# Altium schematic sheet MCU.SchDoc
size A4; Date: 31.05.2020; ApprovedBy: WirelessMan; CheckedBy: WirelessMan; Author: WirelessMan; DrawnBy: WirelessMan; Engineer: WirelessMan
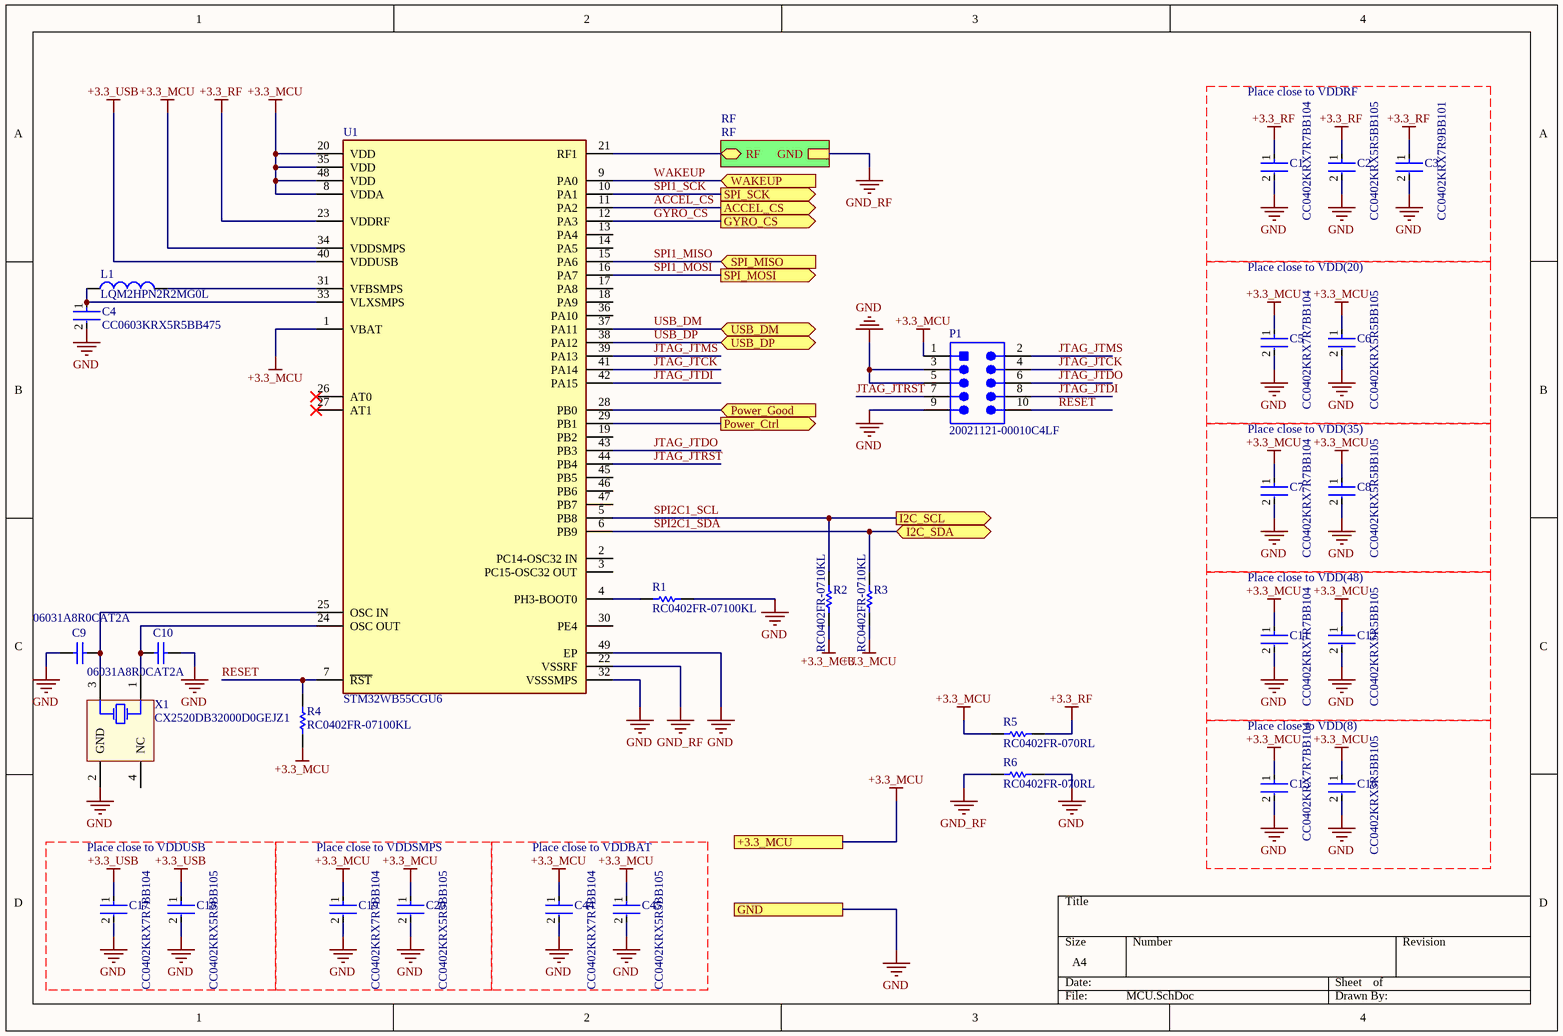
[diagram p0: MCU.SchDoc]

## Parts
C1  CC0402KRX7R7BB104  [FP-CC0402-MFG]
C2  CC0402KRX5R5BB105  [FP-CC0402-MFG]
C3  CC0402KRX7R9BB101  [FP-CC0402-MFG]
C4  CC0603KRX5R5BB475  [FP-CC0603-DA-MFG]
C5  CC0402KRX7R7BB104  [FP-CC0402-MFG]
C6  CC0402KRX5R5BB105  [FP-CC0402-MFG]
C7  CC0402KRX7R7BB104  [FP-CC0402-MFG]
C8  CC0402KRX5R5BB105  [FP-CC0402-MFG]
C9  06031A8R0CAT2A  [CAPC1608X90X35LL15T15]
C10  06031A8R0CAT2A  [CAPC1608X90X35LL15T15]
C11  CC0402KRX7R7BB104  [FP-CC0402-MFG]
C12  CC0402KRX5R5BB105  [FP-CC0402-MFG]
C15  CC0402KRX7R7BB104  [FP-CC0402-MFG]
C16  CC0402KRX5R5BB105  [FP-CC0402-MFG]
C17  CC0402KRX7R7BB104  [FP-CC0402-MFG]
C18  CC0402KRX5R5BB105  [FP-CC0402-MFG]
C19  CC0402KRX7R7BB104  [FP-CC0402-MFG]
C20  CC0402KRX5R5BB105  [FP-CC0402-MFG]
C44  CC0402KRX7R7BB104  [FP-CC0402-MFG]
C45  CC0402KRX5R5BB105  [FP-CC0402-MFG]
L1  LQM2HPN2R2MG0L  [INDC2520X100X60ML20T20]
P1  20021121-00010C4LF  [HDR2X5_SMT]
R1  RC0402FR-07100KL  [RESC1005X40X25NL05T10]
R2  RC0402FR-0710KL  [RESC1005X40X25ML05T10]
R3  RC0402FR-0710KL  [RESC1005X40X25ML05T10]
R4  RC0402FR-07100KL  [RESC1005X40X25NL05T10]
R5  RC0402FR-070RL  [RESC1005X40X25NL05T10]
R6  RC0402FR-070RL  [RESC1005X40X25NL05T10]
U1  STM32WB55CGU6  [FP-STM32WB55CGU6-MFG]
X1  CX2520DB32000D0GEJZ1  [AVX-CX2520DB32000D0GEJZ1-4_V]

## Sub-sheets
RF = RF: RF (bidir), GND

## Ports
+3.3_MCU, ACCEL_CS (out), GND, GYRO_CS (out), I2C_SCL (out), I2C_SDA (bidir), Power_Ctrl (out), Power_Good (in), SPI_MISO (in), SPI_MOSI (out), SPI_SCK (out), USB_DM (bidir), USB_DP (bidir), WAKEUP (in)

## Nets
+3.3_MCU: C5.1 C6.1 C7.1 C8.1 C11.1 C12.1 C15.1 C16.1 C19.1 C20.1 C44.1 C45.1 P1.1 R2.1 R3.1 R4.1 R5.1 U1.1(VBAT) U1.8(VDDA) U1.20(VDD) U1.34(VDDSMPS) U1.35(VDD) U1.48(VDD) ; port +3.3_MCU
+3.3_RF: C1.1 C2.1 C3.1 R5.2 U1.23(VDDRF)
+3.3_USB: C17.1 C18.1 U1.40(VDDUSB)
GND: C1.2 C2.2 C3.2 C4.2 C5.2 C6.2 C7.2 C8.2 C9.1 C10.2 C11.2 C12.2 C15.2 C16.2 C17.2 C18.2 C19.2 C20.2 C44.2 C45.2 P1.3 P1.5 P1.9 R1.1 R6.2 U1.32(VSSSMPS) U1.49(EP) X1.2(GND) ; port GND
GND_RF: R6.1 U1.22(VSSRF) ; sheet RF/GND
ACCEL_CS: U1.11(PA2) ; port ACCEL_CS
GYRO_CS: U1.12(PA3) ; port GYRO_CS
JTAG_JTCK: P1.4 U1.41(PA14)
JTAG_JTDI: P1.8 U1.42(PA15)
JTAG_JTDO: P1.6 U1.43(PB3)
JTAG_JTMS: P1.2 U1.39(PA13)
JTAG_JTRST: P1.7 U1.44(PB4)
Power_Ctrl: U1.29(PB1) ; port Power_Ctrl
Power_Good: U1.28(PB0) ; port Power_Good
RESET: P1.10 R4.2 U1.7(~{RST})
SPI1_MISO: U1.15(PA6) ; port SPI_MISO
SPI1_MOSI: U1.16(PA7) ; port SPI_MOSI
SPI1_SCK: U1.10(PA1) ; port SPI_SCK
SPI2C1_SCL: R2.2 U1.5(PB8) ; port I2C_SCL
SPI2C1_SDA: R3.2 U1.6(PB9) ; port I2C_SDA
USB_DM: U1.37(PA11) ; port USB_DM
USB_DP: U1.38(PA12) ; port USB_DP
WAKEUP: U1.9(PA0) ; port WAKEUP
NetC4_1: C4.1 L1.1 U1.33(VLXSMPS)
NetC9_2: C9.2 U1.25(OSC_IN) X1.3(HOT)
NetC10_1: C10.1 U1.24(OSC_OUT) X1.1(HOT)
NetL1_2: L1.2 U1.31(VFBSMPS)
NetR1_2: R1.2 U1.4(PH3-BOOT0)
NetU1_21: U1.21(RF1) ; sheet RF/RF

Not connected (* = marked no-connect by the designer): U1 2(PC14-OSC32_IN) 3(PC15-OSC32_OUT) 13(PA4) 14(PA5) 17(PA8) 18(PA9) 19(PB2) 26(AT0)* 27(AT1)* 30(PE4) 36(PA10) 45(PB5) 46(PB6) 47(PB7); X1 4(NC)

## Notes on the sheet
- Place close to VDDRF
- Place close to VDD(20)
- Place close to VDD(35)
- Place close to VDD(48)
- Place close to VDD(8)
- Place close to VDDUSB
- Place close to VDDSMPS
- Place close to VDDBAT

## Library data of the parts
C1 C5 C7 C11 C15 C17 C19 C44 = CMP-03422-000048-1: CAP CER 0.1UF 16V X7R 0402; Manufacturer: YAGEO; Material: Ceramic; Automotive Grade: NA; Capacitance: 100 nF; Temperature Coefficient: 30ppm/°C; Tolerance: 0.1; Value: 100 nF; Device Class L1: Passive Components; Temperature Range Low: -55°C; Device Class L3: Ceramic Capacitors; Temperature Characteristic: X7R; Ipc Land Pattern Name: CAPC10050X50; Temperature Range High: +125°C; Voltage Rating: 16 V; Temperature: -55°C to +125°C; RoHS: TRUE; Automotive: No; Height: 0.55mm; Device Class L2: Capacitors; Digikey Description: CAP CER 0.1UF 16V X7R 0402; Package: CC0402; Footprint Url: http://www.yageo.com/exep/pages/download/literatures/UPY-C_GEN_24.pdf; ComponentLink2Description: Datasheet; Category: Cap; Lead Free: Yes; Octopart: https://octopart.com/cc0402krx7r7bb104-yageo-42244624; ComponentLink2URL: http://www.yageo.com/documents/recent/UPY-GP_NP0_16V-to-50V_16.pdf; Manufacturer Part Number: CC0402KRX7R7BB104; Mouser Description: 0402 0.1 uF 16 V ±10 % Tolerance X7R SMT Multilayer Ceramic Capacitor
C2 C6 C8 C12 C16 C18 C20 C45 = CMP-03422-000496-1: CAP CER 1UF 6.3V X5R 0402; Manufacturer: YAGEO; Automotive Grade: NA; Material: Ceramic; Tolerance: 0.1; Temperature Coefficient: 30ppm/°C; Voltage Rating: 6.3 V; Temperature Range Low: -55°C; Digikey Description: CAP CER 1UF 6.3V X5R 0402; Capacitance: 1 uF; Height: 0.55mm; Automotive: No; ComponentLink2URL: http://www.yageo.com/documents/recent/UPY-GP_NP0_16V-to-50V_16.pdf; Device Class L2: Capacitors; RoHS: TRUE; Temperature Range High: +125°C; Device Class L3: Ceramic Capacitors; Device Class L1: Passive Components; Temperature Characteristic: X5R; Package: CC0402; Octopart: https://octopart.com/cc0402krx5r5bb105-yageo-42244618; ComponentLink2Description: Datasheet; Temperature: -55°C to +125°C; Manufacturer Part Number: CC0402KRX5R5BB105; Mouser Description: Multilayer Ceramic Capacitors MLCC - SMD/SMT 1uF 6.3V X5R 10%; Category: Cap; Footprint Url: http://www.yageo.com/exep/pages/download/literatures/UPY-C_GEN_24.pdf; Lead Free: Yes; Ipc Land Pattern Name: CAPC10050X50; Value: 1 uF
C3 = CMP-03422-000006-1: CAP CER 100PF 50V X7R 0402; Manufacturer: YAGEO; Temperature Coefficient: 30ppm/°C; Material: Ceramic; Tolerance: 0.1; Automotive Grade: NA; Device Class L2: Capacitors; Temperature: -55°C to +125°C; Temperature Range Low: -55°C; ComponentLink2Description: Datasheet; Automotive: No; Package: CC0402; Device Class L1: Passive Components; Value: 100 pF; Octopart: https://octopart.com/cc0402krx7r9bb101-yageo-42334067; Device Class L3: Ceramic Capacitors; Category: Cap; Height: 0.55mm; Ipc Land Pattern Name: CAPC10050X50; Digikey Description: CAP CER 100PF 50V X7R 0402; RoHS: TRUE; Footprint Url: http://www.yageo.com/exep/pages/download/literatures/UPY-C_GEN_24.pdf; Manufacturer Part Number: CC0402KRX7R9BB101; Voltage Rating: 50 V; Lead Free: Yes; Temperature Range High: +125°C; Capacitance: 100 pF; Temperature Characteristic: X7R; Mouser Description: Multilayer Ceramic Capacitor, Cc Series, 100 Pf, - 10%, X7r, 50 V, 0402 [1005 Metric]; ComponentLink2URL: http://www.yageo.com/documents/recent/UPY-GP_NP0_16V-to-50V_16.pdf
C4 = CMP-03422-000495-1: CAP CER 4.7UF 6.3V X5R 0603; Manufacturer: YAGEO; Tolerance: 0.1; Temperature Coefficient: 15%; Material: Ceramic; Voltage Rating: 6.3 V; Height: 0.9mm; Temperature Characteristic: X5R; Value: 4.7 uF; ComponentLink2Description: Datasheet; Mouser Description: Multilayer Ceramic Capacitor, CC Series, 4.7 - F, - 10%, X5R, 6.3 V, 0603 [1608 Metric]; Manufacturer Part Number: CC0603KRX5R5BB475; Voltage: 6.3 V; Device Class L3: Ceramic Capacitors; Temperature: -55°C to +125°C; Octopart: https://octopart.com/cc0603krx5r5bb475-yageo-42244632; Digikey Description: CAP CER 4.7UF 6.3V X5R 0603; Package: CC0603-DA; Device Class L2: Capacitors; Category: Cap; Footprint Url: http://www.yageo.com/exep/pages/download/literatures/UPY-C_GEN_24.pdf; ComponentLink2URL: http://www.yageo.com/documents/recent/UPY-GPHC_X7R_6.3V-to-50V_18.pdf; Temperature Range High: +125°C; Automotive: No; Temperature Range Low: -55°C; Lead Free: Yes; Capacitance: 4.7 uF; Device Class L1: Passive Components; RoHS: TRUE
C9 C10 = CMP-2006-04063-1: Manufacturer: AVX Interconnect / Elco; Part Number: 06031A8R0CAT2A
L1 = CMP-1662-00028-1: Chip Inductor, 2.2 uH, +/- 20%, -55 to 125 degC, 1008 (2520 Metric), RoHS, Tape and Reel; Voltage Rating (DC): 50 V; Capacitance: 220 uF; Case\Package: Radial; Lead Pitch: 5 mm; PackageDescription: 2-Pin Surface Mounted Device, Body 2.5 x 2 mm; ComponentLink2URL: http://psearch.en.murata.com/inductor/product/LQM2HPN2R2MG0%23.pdf; Height: 12.5 mm; PackageReference: 1008; Voltage Rating: 50 V; ComponentLink1URL: http://www.murata.com/; Package Quantity: 200; REACH SVHC: No SVHC; ComponentLink1Description: Manufacturer URL; Length: 12.5 mm; Max Operating Temperature: 85 degC; DatasheetVersion: Aug-16; Diameter: 10 mm; RoHSCompliant: true; Packaging: Bulk; Mount: Through Hole; Pins: 2; ComponentLink2Description: Datasheet; Tolerance: 20%; Min Operating Temperature: -40 degC; Radiation Hardening: No
P1 = CMP-2000-05523-1: Male Header, Pitch 1.27 mm, 2 x 5 Position, Height 4.55 mm, -40 to 85 degC, RoHS, Tape and Reel; Brand: FCI; Mating Post Length: 3.05mm; Voltage Rating: 125V; Contact resistance Max: 30MOhm; Number of Positions: 10; Pitch: 1.27mm; Current Rating: 1A; Stack Height: 3mm; Mounting Angle: Vertical; Package Version: Rev. J, 03/2013; Contact Plating: Gold; Packaging: Reel; Package Reference: 20021121; Termination Style: SMD; Series: Minitek; Mounting Technology: SurfaceMount; RoHS: Details; Manufacturer: FCI; Number of Rows: 2; Package Description: 10-Leads Header, Body 3.43 x 6.35, Pitch 1.27 mm; Datasheet URL: https://datasheet.ciiva.com/11749/0900766b8118d62a-11749057.pdf; Gender: Male; Mounting Style: SMD/SMT; Manufacturer URL: http://portal.fciconnect.com/; Factory Pack Quantity: 600; Type: Unshrouded; Number of Positions / Contacts: 10; Datasheet Version: 06/2011; Package URL: https://datasheet.ciiva.com/26853/getdatasheetpartid-177140-26853984.pdf; Product Type: Headers; Contact Material: CopperAlloy; Product Category: Headers&WireHousings
R1 R4 = CMP-2002-07343-1: Manufacturer: Yageo / Phycomp; Part Number: RC0402FR-07100KL
R2 R3 = CMP-2002-07353-1: Manufacturer: Yageo / Phycomp; Part Number: RC0402FR-0710KL
R5 R6 = CMP-2002-07342-1: Manufacturer: Yageo; Part Number: RC0402FR-070RL
U1 = CMP-12105-000013-1: ULTRA-LOW-POWER DUAL CORE ARM CO; Manufacturer: STMicroelectronics; Number Of Cores: 1; Number Of I2C Channels: 2; Interface: I2C,SPI,UART,USART,2-Wire,USB,IrDA,Other; Core Architecture: ARM Cortex-M4; Data Bus Width: 32bits; Memory Size: 1MBytes; Number Of Pwm Channels: 14; Max Supply Voltage: 3.6V; Standoff Height: 0mm; Number Of Timers/Counters: 6; Frequency: 64MHz; Max Junction Temp: +105°C; Number Of I/Os: 30; Min Supply Voltage: 1.71V; Number Of Adc Channels: 13; Ram Size: 256KBytes; Memory Type: FLASH; Octopart: https://octopart.com/stm32wb55cgu6-stmicroelectronics-98750847; Temperature Range High: +105°C; RoHS: TRUE; Number Of Spi Channels: 1; Category: IC; Device Class L1: Integrated Circuits (ICs); Lead Free: Yes; Height: 0.65mm; Number Of A/D Converters: 1; Package: UFQFPN48; Number Of Usb Channels: 1; Number Of Uart Channels: 2; Temperature Range Low: -40°C; Ambient Temperature Range Low: -40°C; Device Class L3: Microcontrollers; Manufacturer Part Number: STM32WB55CGU6; Temperature: -40°C to +105°C; ComponentLink2URL: https://www.st.com/resource/en/datasheet/stm32wb55cg.pdf; Device Class L2: Embedded Processors and Controllers; Digikey Description: ULTRA-LOW-POWER DUAL CORE ARM CO; ComponentLink2Description: Datasheet; Ambient Temperature Range High: +85°C; Automotive: No
X1 = CMP-0449-00001-2: Crystal, 32 MHz, 8 pF, -10 to 70 degC, Surface Mount 2.5 x 2.0 mm; Manufacturer: Kyocera; Load Capacitance: 8 pF; Frequency Range: 32000 kHz; Packing: Tape and Reel; Motional Series Resistance: 50 ohm (max); Drive Level: 10uW (100uW max.); ComponentLink3Description: Package Specification; ComponentLink1Description: Manufacturer URL; ComponentLink2Description: Datasheet; PackageDescription: 4-Pin Hand Drawnï¼ŒBody 2.5x2mm; ComponentLink1URL: http://global.kyocera.com/; ComponentLink3URL: http://global.kyocera.com/prdct/electro/pdf/xtal/cx2520db_cs_e.pdf; Operating Temperature: -10 to 70 degC; ComponentLink2URL: http://global.kyocera.com/prdct/electro/pdf/xtal/cx2520db_cs_e.pdf; PartNumber: CX2520DB32000D0GEJZ1; PackageReference: CX2520DB32000D0GEJZ1-4; Mounting Technology: Surface Mount